# EAGLE design uggy44 (EAGLE 4.16)
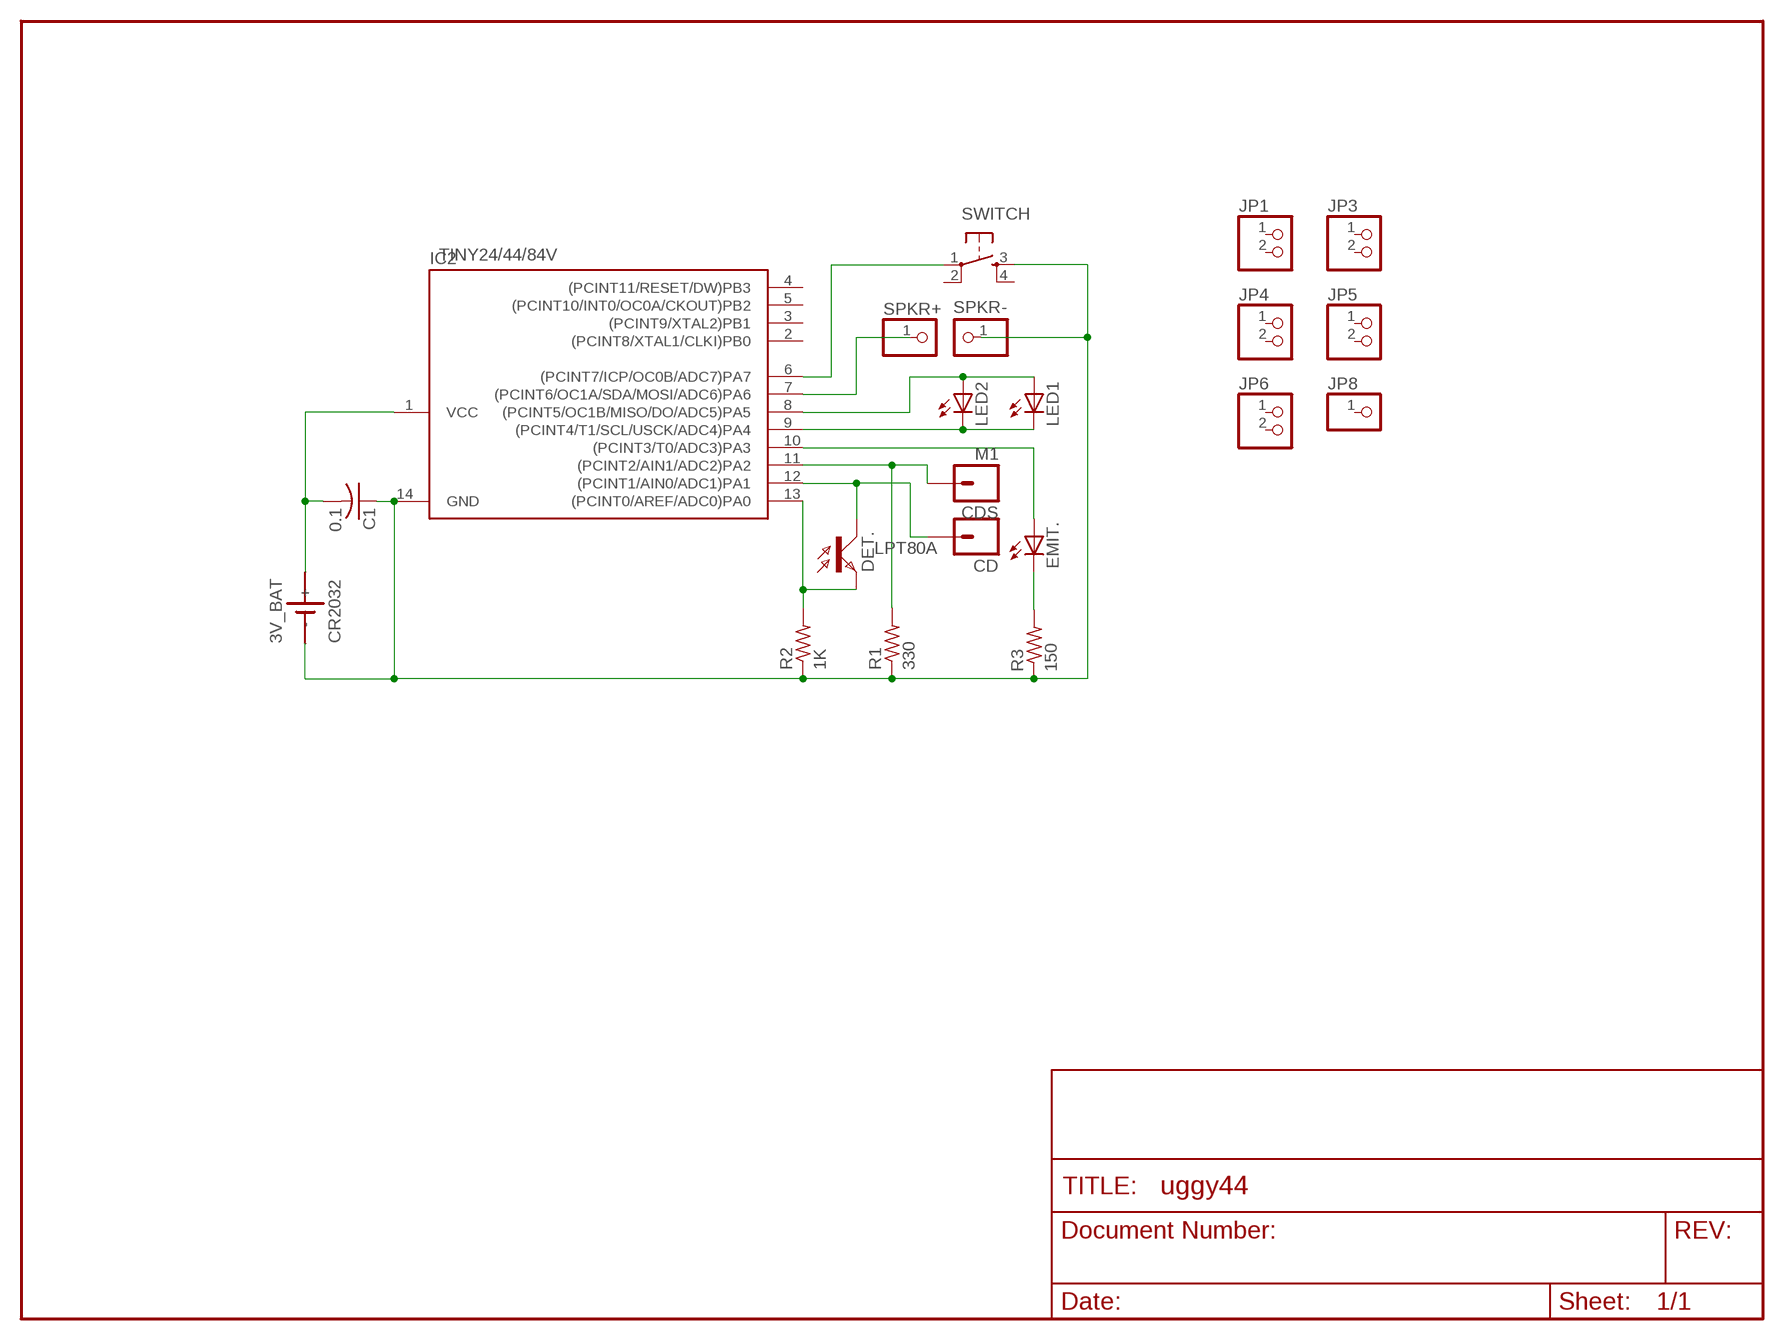
[diagram p0: schematic, sheet 1]

## Parts
3V_BAT  CR2032  SN2032  [SN2032]
C1  0.1  C-US025-024X044  [C025-024X044]
CD  M01PTH  [1X01]
CDS  M1  M01PTH  [1X01]
DET.  LPT80A  [LPT80A]
EMIT.  LED3MM  [LED3MM]
IC2  TINY24/44/84V  TINY24/44/84-PU  [DIL14]
JP1  PINHD-1X2  [1X02]
JP3  PINHD-1X2  [1X02]
JP4  PINHD-1X2  [1X02]
JP5  PINHD-1X2  [1X02]
JP6  PINHD-1X2  [1X02]
JP8  PINHD-1X1  [1X01]
LED1  LED3MM  [LED3MM]
LED2  LED3MM  [LED3MM]
R1  330  R-US_0204/5  [0204/5]
R2  1K  R-US_0204/5  [0204/5]
R3  150  R-US_0204/5  [0204/5]
SPKR+  PINHD-1X1  [1X01]
SPKR-  PINHD-1X1  [1X01]
SWITCH  TAC_SWITCHPTH  [TACTILE-PTH]

## Nets
GND: 3V_BAT.- C1.1 IC2.14(GND) R1.1 R2.1 R3.1 SPKR-.1 SWITCH.3
N$1: CDS.1 IC2.11((PCINT2/AIN1/ADC2)PA2) R1.2
N$2: DET..E IC2.13((PCINT0/AREF/ADC0)PA0) R2.2
N$3: CD.1 DET..C IC2.12((PCINT1/AIN0/ADC1)PA1)
N$4: IC2.7((PCINT6/OC1A/SDA/MOSI/ADC6)PA6) SPKR+.1
N$5: EMIT..K(C) R3.2
N$7: IC2.6((PCINT7/ICP/OC0B/ADC7)PA7) SWITCH.1
N$8: EMIT..A IC2.10((PCINT3/T0/ADC3)PA3)
N$21: IC2.8((PCINT5/OC1B/MISO/DO/ADC5)PA5) LED1.A LED2.A
N$22: IC2.9((PCINT4/T1/SCL/USCK/ADC4)PA4) LED1.K(C) LED2.K(C)
VCC: 3V_BAT.+ C1.2 IC2.1(VCC)
Unconnected: IC2.2((PCINT8/XTAL1/CLKI)PB0) IC2.3((PCINT9/XTAL2)PB1) IC2.4((PCINT11/RESET/DW)PB3) IC2.5((PCINT10/INT0/OC0A/CKOUT)PB2) JP1.1 JP1.2 JP3.1 JP3.2 JP4.1 JP4.2 JP5.1 JP5.2 JP6.1 JP6.2 JP8.1 SWITCH.2 SWITCH.4

## Library data of the parts
3V_BAT = 1mylib:SN2032: LI BATTERY
C1 = rcl:C-US: CAPACITOR, American symbol
CD CDS = 1mylib:M01: Header 1 Standard 1-pin 0.1" header. Use with straight break away headers (SKU : PRT-00116), right angle break away headers (PRT-00553), swiss pins (PRT-00743), machine pins (PRT-00117), and female headers (PRT-00115).
DET. = opto-trans-siemens:LPT80A: PHOTO TRANSISTOR
EMIT. LED1 LED2 = led:LED: LED OSRAM: - CHIPLED LG R971, LG N971, LY N971, LG Q971, LY Q971, LO R971, LY R971 LH N974, LH R974 LS Q976, LO Q976, LY Q976 LO Q996 - Hyper CHIPLED LW Q18S LB Q993, LB Q99A, LB R99A - SideLED LS A670, LO A670, LY A670, LG A670, LP A670 LB A673, LV A673, LT A673, LW A673 LH A674 LY A675 LS A676, LA A676, LO A676, LY A676, LW A676 LS A679, LY A679, LG A679 - Hyper Micro SIDELED® LS Y876, LA Y876, LO Y876, LY Y876 LT Y87S - SmartLED LW L88C, LW L88S LB L89C, LB L89S, LG L890 LS L89K, LO L89K, LY L89K LS L896, LA L896, LO L896, LY L896 - TOPLED LS T670, LO T670, LY T670, LG T670, LP T670 LSG T670, LSP T670, LSY T670, LOP T670, LYG T670 LG T671, LOG T671, LSG T671 LB T673, LV T673, LT T673, LW T673 LH T674 LS T676, LA T676, LO T676, LY T676, LB T676, LH T676, LSB T676, LW T676 LB T67C, LV T67C, LT T67C, LS T67K, LO T67K, LY T67K, LW E67C LS E67B, LA E67B, LO E67B, LY E67B, LB E67C, LV E67C, LT E67C LW T67C LS T679, LY T679, LG T679 LS T770, LO T770, LY T770, LG T770, LP T770 LB T773, LV T773, LT T773, LW T773 LH T774 LS E675, LA E675, LY E675, LS T675 LS T776, LA T776, LO T776, LY T776, LB T776 LHGB T686 LT T68C, LB T68C - Hyper Mini TOPLED® LB M676 - Mini TOPLED Santana® LG M470 LS M47K, LO M47K, LY M47K Source: http://www.osram.convergy.de - LUMILED® LXK2-PW12-R00, LXK2-PW12-S00, LXK2-PW14-U00, LXK2-PW14-V00 LXK2-PM12-R00, LXK2-PM12-S00, LXK2-PM14-U00 LXK2-PE12-Q00, LXK2-PE12-R00, LXK2-PE12-S00, LXK2-PE14-T00, LXK2-PE14-U00 LXK2-PB12-K00, LXK2-PB12-L00, LXK2-PB12-M00, LXK2-PB14-N00, LXK2-PB14-P00, LXK2-PB14-Q00 LXK2-PR12-L00, LXK2-PR12-M00, LXK2-PR14-Q00, LXK2-PR14-R00 LXK2-PD12-Q00, LXK2-PD12-R00, LXK2-PD12-S00 LXK2-PH12-R00, LXK2-PH12-S00 LXK2-PL12-P00, LXK2-PL12-Q00, LXK2-PL12-R00 Source: www.luxeon.com
IC2 = avr-4:TINY24/44/84
JP1 JP3-JP6 = pinhead:PINHD-1X2: PIN HEADER
JP8 SPKR+ SPKR- = pinhead:PINHD-1X1: PIN HEADER
R1-R3 = rcl:R-US_: RESISTOR, American symbol
SWITCH = SparkFun:TAC_SWITCH: Momentary Switch Button commonly used for reset or general input. Spark Fun Electronics SKU : COM-00097

## Board
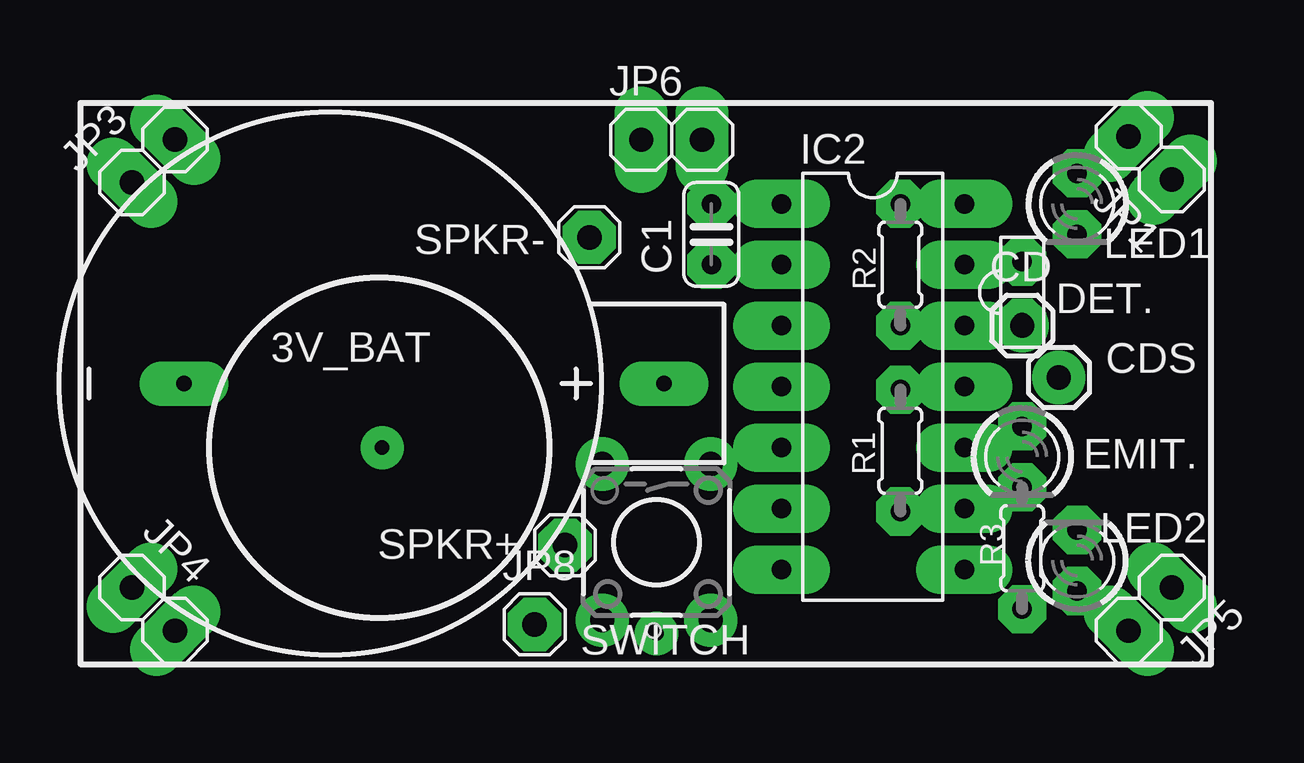
[diagram p1: board, top side]
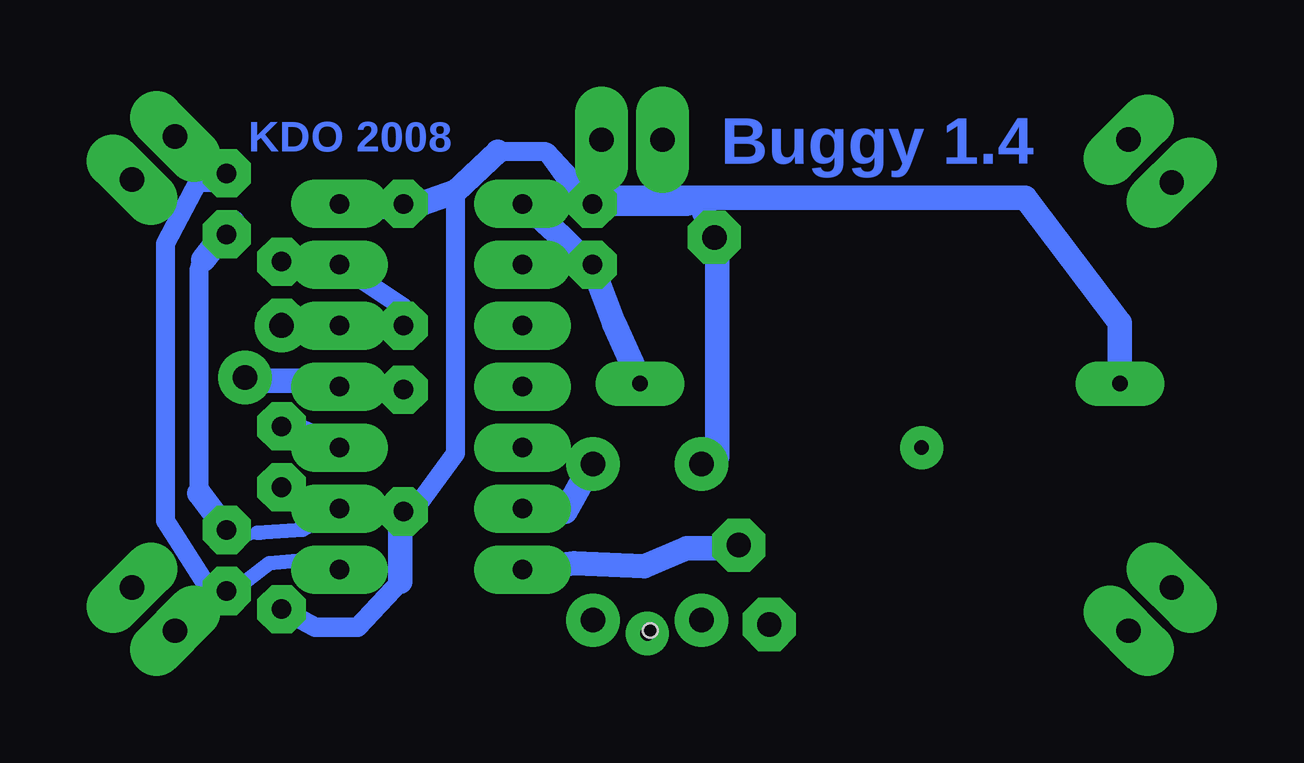
[diagram p2: board, bottom side, seen from below]

No outline drawn. Coordinates in mm, seen from the top.
Copper layers (1*16): Top 0.035mm / dielectric 1.5mm / Bottom 0.035mm
Design rules "Hobby6": minimum track width 0.8mm, minimum drill 0.8mm, track to track 0.6mm, track to pad 0.6mm, pad to pad 0.45mm, via to via 0.6mm, smd to smd 8mil, copper to edge 6mil, drill to drill 8mil, minimum pad ring 0.6mm, minimum via ring 0.6mm, stop-mask expansion 0mil, vias tented up to drill 0mil, thermal gap 10mil
Holes 0.6 mm at 32,10.54

### Footprints (pad centres in the part's own frame; a part is rotated, then mirrored left to right if it is on the bottom)
SN2032 = drill 0.65 long: + 0,13.9; - 0,-6.1
C025-024X044 = drill 0.813 octagon: 1 -1.27,0; 2 1.27,0
1X01 = drill 1.016 round: 1 0,0
LPT80A = drill 0.813 octagon: C 0,-1.27; E 0,1.27
LED3MM = drill 0.813 octagon: A -1.27,0; K 1.27,0
DIL14 = drill 0.813 long: 1 -7.62,-3.81; 2 -5.08,-3.81; 3 -2.54,-3.81; 4 0,-3.81; 5 2.54,-3.81; 6 5.08,-3.81; 7 7.62,-3.81; 8 7.62,3.81; 9 5.08,3.81; 10 2.54,3.81; 11 0,3.81; 12 -2.54,3.81; 13 -5.08,3.81; 14 -7.62,3.81
1X02 = drill 1.016 long: 1 -1.27,0; 2 1.27,0
1X01' = drill 1.016 octagon: 1 0,0
0204/5 = drill 0.813 octagon: 1 -2.54,0; 2 2.54,0
TACTILE-PTH = drill 1.016 round: 1 -3.251,2.261; 2 3.251,2.261; 3 -3.251,-2.261; 4 3.251,-2.261

### Placement (x,y rotation side)
3V_BAT  18.54,20.83 270 top
C1  34.42,27.05 270 top
CD  47.37,23.24 0 top
CDS  48.9,21.08 0 top
DET.  47.37,24.64 0 top
EMIT.  47.37,17.78 270 top
IC2  41.15,20.7 270 top
JP1  52.7,30.23 135 top
JP3  11.18,30.1 45 top
JP4  11.18,11.43 315 top
JP5  52.7,11.43 225 top
JP6  32.77,30.99 0 top
JP8  [1X01']  27.05,10.79 0 top
LED1  49.66,28.32 270 top
LED2  49.66,13.46 90 top
R1  42.29,18.03 90 top
R2  42.29,25.78 270 top
R3  47.37,13.97 90 top
SPKR+  [1X01']  28.32,14.1 0 top
SPKR-  [1X01']  29.34,26.92 0 top
SWITCH  32.13,14.22 270 top

### Tracks (layer width: path | path; a pad name or v marks a point on that pad's centre or on a via)
GND
  Bottom 0.254: 3V_BAT.-
  Bottom 0.406: R1.1 42.42,15.49
  Bottom 0.8: 43.18,28.19 R2.1 41.91,28.19 | 44.45,28.19 IC2.14 | 36.32,30.48 34.67,28.19 C1.1 | 36.32,30.48 38.35,30.48 | 40.13,28.83 40.13,17.91 41.91,15.49 R1.1 | 3V_BAT.- 12.45,21.59 | 30.48,28.32 29.97,28.45 | 34.54,28.57 36.32,30.48 | SPKR-.1 29.21,26.67 | 29.21,17.78 SWITCH.3
  Bottom 0.813: R3.1 45.97,10.67 44.2,10.67 42.42,12.57
  Bottom 1.016: 43.18,28.19 44.45,28.19 | C1.1 30.48,28.32 | 41.91,28.19 40.13,28.83 38.35,30.48 | 42.42,15.49 42.42,12.57 | 29.97,28.45 SPKR-.1 | 29.21,26.67 29.21,17.78 | 34.54,28.57 16.38,28.57 12.45,23.37 3V_BAT.-
N$1
  Bottom 0.254: 48.77,20.95 48.77,21.08 CDS.1
  Bottom 0.61: IC2.11 44.96,20.95
  Bottom 0.8: 44.45,20.57 IC2.11
  Bottom 1.016: R1.2 44.45,20.57 | 44.96,20.95 48.77,20.95
N$2
  Bottom 0.8: IC2.13 42.29,24 R2.2 | IC2.13 44.45,25.65 | IC2.13 45.72,25.78 | DET..E 46.99,25.4 46.99,25.78
  Bottom 1.016: 45.72,25.78 46.99,25.78
N$3
  Bottom 0.8: IC2.12 45.21,23.24 | 47.24,23.24 CD.1 46.99,22.86 DET..C
  Bottom 1.016: 45.21,23.24 47.24,23.24
N$4
  Bottom 0.8: 32.26,13.21 32,13.21 | SPKR+.1 29.21,13.97
  Bottom 1.016: IC2.7 35.18,13.34 32.26,13.21 30.48,13.97 29.21,13.97
N$7
  Bottom 0.406: 34.54,17.14 34.54,17.27 34.54,17.65
  Bottom 0.8: 34.54,17.65 34.29,17.78 SWITCH.1
  Bottom 1.016: IC2.6 35.56,15.49 34.54,17.27
N$8
  Bottom 0.61: EMIT..A 47.12,19.05 47.37,19.18
  Bottom 1.016: IC2.10 47.37,19.18
N$9  (via drill 0.6 pad 0.3)
  other vias: 32.13,10.41
N$10  (via drill 0.6 pad 0.3)
  other vias: 20.7,18.16
N$21
  Bottom 0.406: 49.15,11.81 LED2.A 49.91,11.81 49.15,11.81 | 49.53,12.06 49.15,11.81
  Bottom 0.61: IC2.8 46.48,13.46 47.88,13.34 49.53,12.06
  Bottom 0.8: 50.84,29.24 52.2,26.67 52.2,15.11 50.16,11.94 LED2.A | 50.84,29.24 50.16,29.97 | LED1.A 49.53,29.21 50.8,29.21 50.84,29.24
N$22
  Bottom 0.305: 48.26,14.61 49.78,13.97
  Bottom 0.406: 49.78,13.97 LED2.K
  Bottom 0.61: IC2.9 46.48,14.73 48.39,14.61 48.26,14.61
  Bottom 0.8: 50.8,16.26 50.8,25.65 50.64,25.98 50.67,26.04 49.53,26.92 LED1.K
  Bottom 1.016: 50.64,25.98 49.4,27.56 | LED2.K 50.8,16.26
VCC
  Bottom 0.406: 36.96,28.07 37.08,28.07 37.08,28.19 | 34.54,25.65 34.54,25.78 C1.2
  Bottom 0.8: 36.96,28.07 IC2.1 | 3V_BAT.+ 32.38,20.83 | 34.29,25.4 C1.2
  Bottom 1.016: 32.38,20.83 33.53,23.37 34.29,25.4 | 37.08,28.19 35.69,26.92 34.54,25.78

### Text on the board
Bottom: Buggy 1.4 | KDO 2008